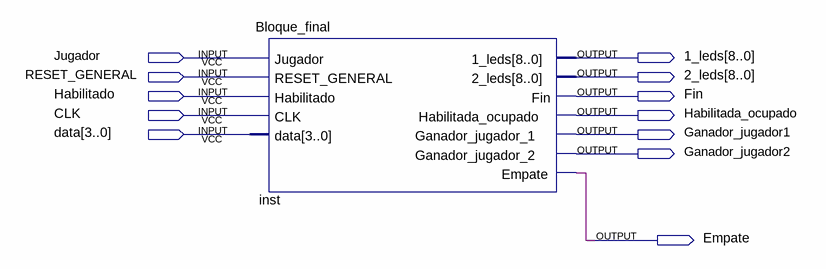
[diagram p0: schematic sheet]
// Quartus schematic Prueba_borrar.bdf as structural Verilog: 1 symbols, 12 pins
module Prueba_borrar (
  input  Jugador,
  input  RESET_GENERAL,
  input  Habilitado,
  input  CLK,
  input  [3:0] data,
  output [8:0] \1_leds ,
  output [8:0] \2_leds ,
  output Fin,
  output Habilitada_ocupado,
  output Ganador_jugador1,
  output Ganador_jugador2,
  output Empate
);

  Bloque_final inst (
    .Jugador(Jugador), .RESET_GENERAL(RESET_GENERAL), .Habilitado(Habilitado), .CLK(CLK), .data(data),
    .\1_leds (\1_leds ), .\2_leds (\2_leds ), .Fin(Fin), .Habilitada_ocupado(Habilitada_ocupado),
    .Ganador_jugador_1(Ganador_jugador1), .Ganador_jugador_2(Ganador_jugador2), .Empate(Empate));
endmodule
